# Altium schematic sheet Sheet4.SchDoc
size A3; DocumentNumber: 4; SheetNumber: 4; SheetTotal: 4
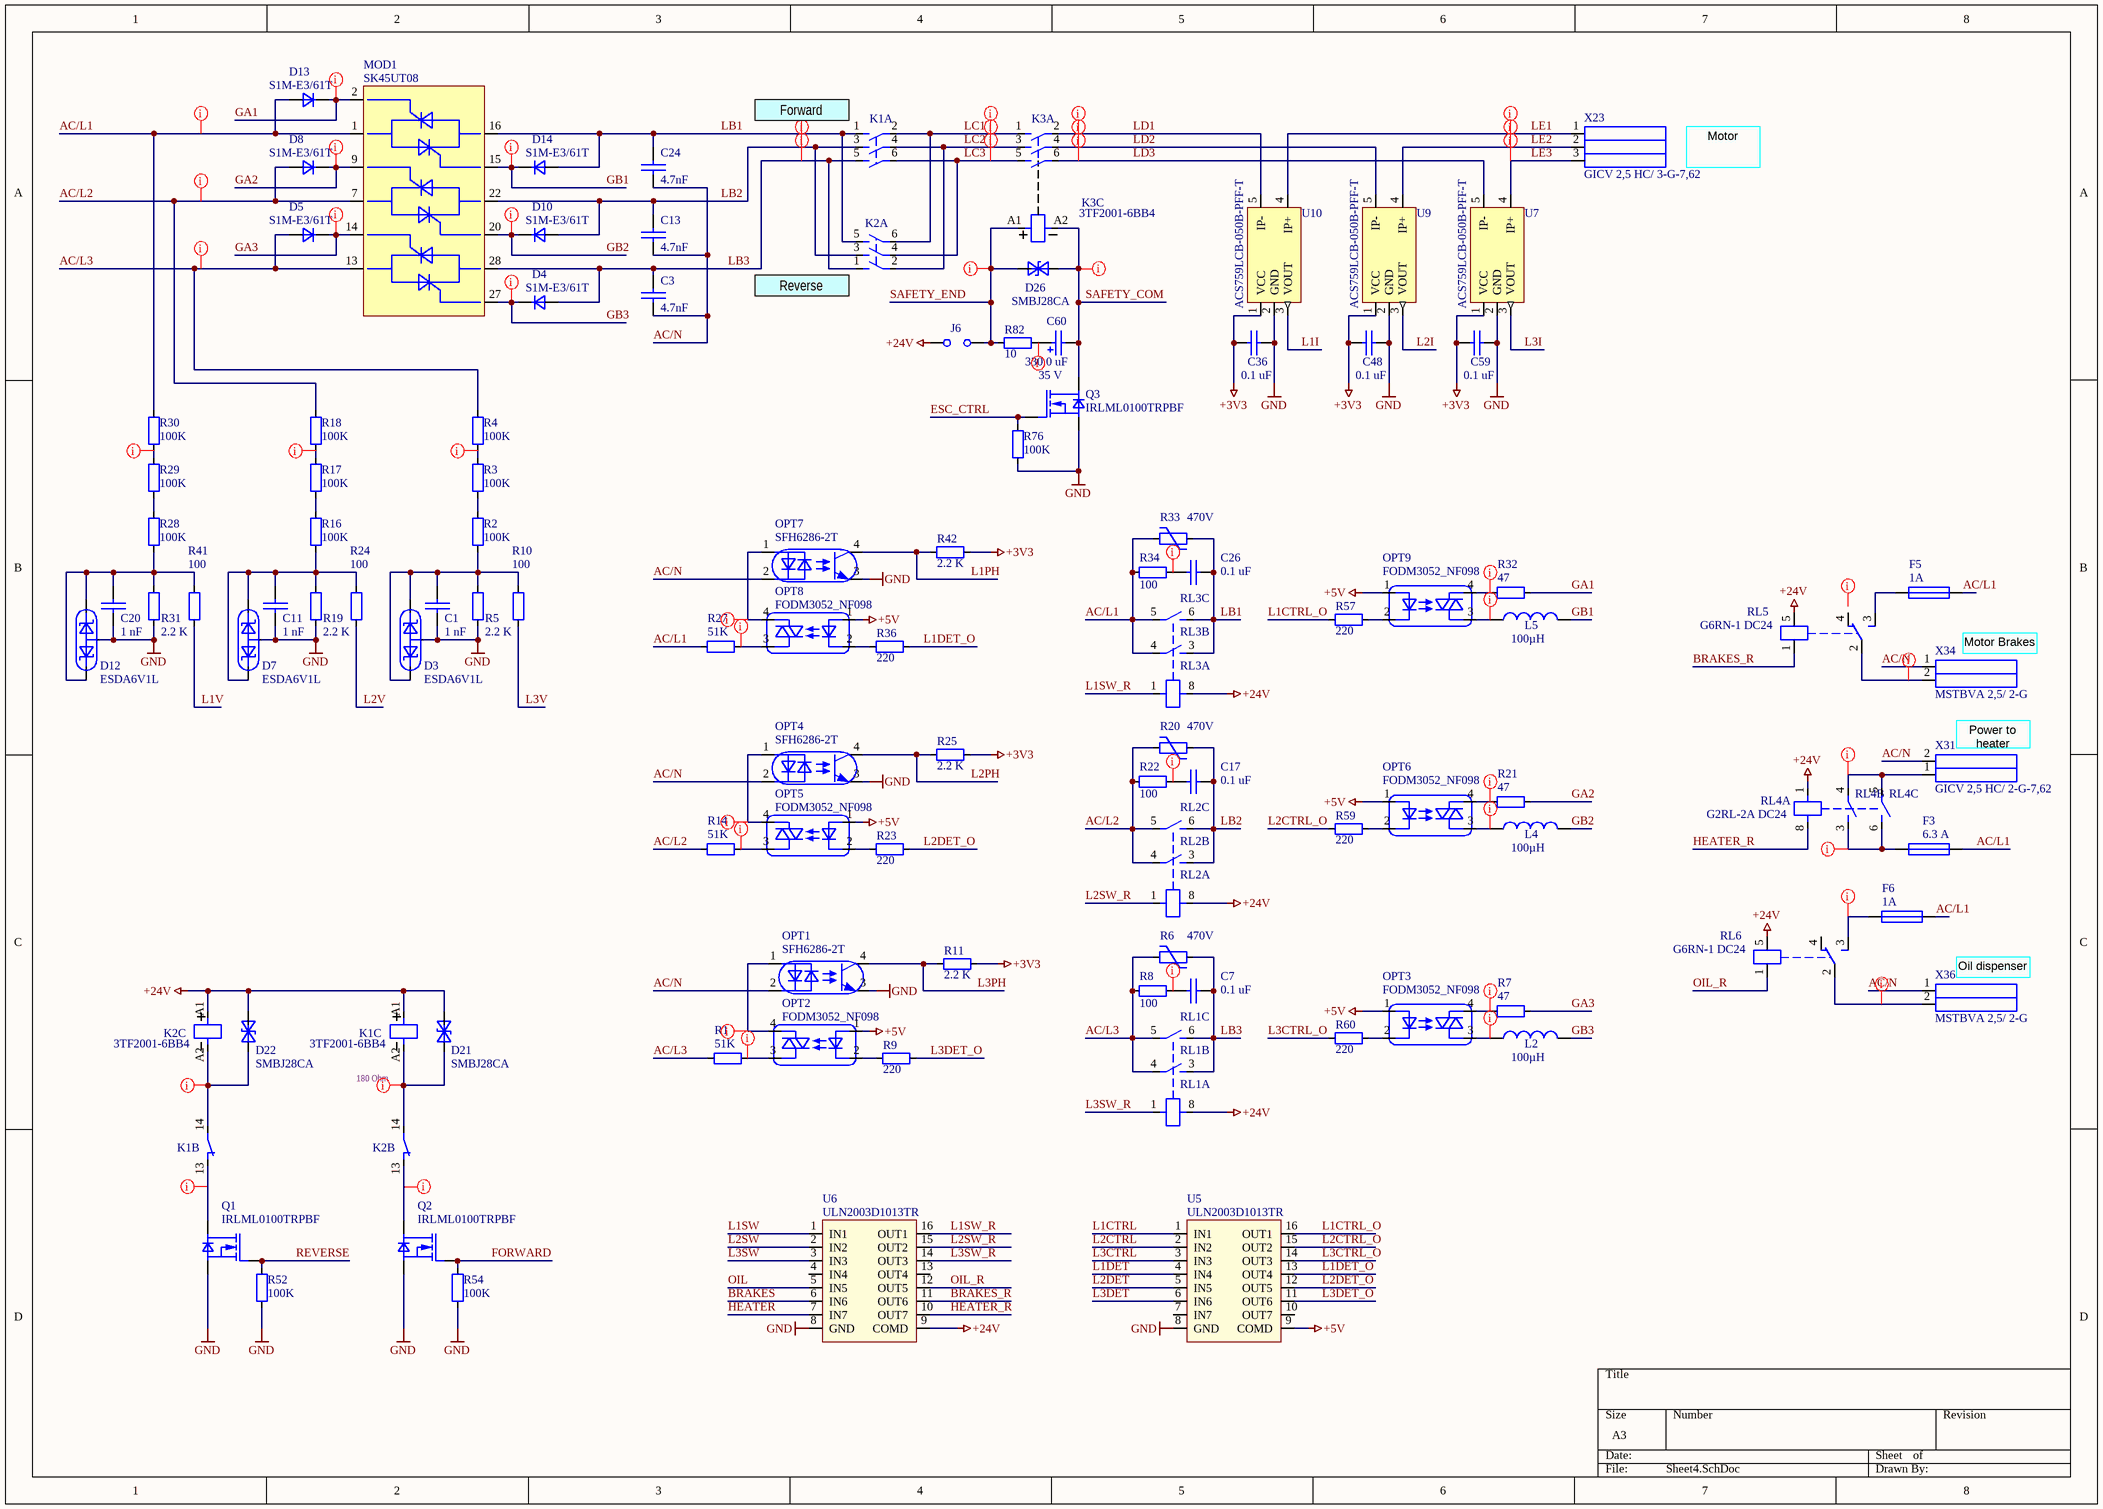
[diagram p0: Sheet4.SchDoc]

## Parts
C1  value 1 nF  [1608[0603]]  (hidden comment: CL10B102KB8NNNC)
C3  value 4.7nF  [DE2E3KH472M]  (hidden comment: DE2E3KH472MA3B)
C7  value 0.1 uF  [R46 Series 18mm]  (hidden comment: R46KI310040M1K1)
C11  value 1 nF  [1608[0603]]  (hidden comment: CL10B102KB8NNNC)
C13  value 4.7nF  [DE2E3KH472M]  (hidden comment: DE2E3KH472MA3B)
C17  value 0.1 uF  [R46 Series 18mm]  (hidden comment: R46KI310040M1K1)
C20  value 1 nF  [1608[0603]]  (hidden comment: CL10B102KB8NNNC)
C24  value 4.7nF  [DE2E3KH472M]  (hidden comment: DE2E3KH472MA3B)
C26  value 0.1 uF  [R46 Series 18mm]  (hidden comment: R46KI310040M1K1)
C36  value 0.1 uF  [1608[0603]]  (hidden comment: CL10B104KA8NNND)
C48  value 0.1 uF  [1608[0603]]  (hidden comment: CL10B104KA8NNND)
C59  value 0.1 uF  [1608[0603]]  (hidden comment: CL10B104KA8NNND)
C60  value 330.0 uF  Voltage: 35 V  [Alum.SMD Cap. 10*10]  (hidden comment: UUD1V331MNL1GS)
D3  ESDA6V1L  [SOT23]
D4  S1M-E3/61T  [SMA]
D5  S1M-E3/61T  [SMA]
D7  ESDA6V1L  [SOT23]
D8  S1M-E3/61T  [SMA]
D10  S1M-E3/61T  [SMA]
D12  ESDA6V1L  [SOT23]
D13  S1M-E3/61T  [SMA]
D14  S1M-E3/61T  [SMA]
D21  SMBJ28CA  [DO-214AA_SMBJ]
D22  SMBJ28CA  [DO-214AA_SMBJ]
D26  SMBJ28CA  [DO-214AA_SMBJ]
F3  value 6.3 A  [FUSE KS21SW]  (hidden comment: BK/HTC-15M)
F5  value 1A  [FUSE KS21SW]  (hidden comment: BK/HTC-15M)
F6  value 1A  [FUSE KS21SW]  (hidden comment: BK/HTC-15M)
J6  PH1-02-TA-HT  [HDR1X2V]  (value not drawn)
K1  3TF2001-6BB4  [3TF2010-6]  (value not drawn)  (parts A,B,C of 3)
K2  3TF2001-6BB4  [3TF2010-6]  (value not drawn)  (parts A,B,C of 3)
K3  3TF2001-6BB4  [3TF2010-6]  (value not drawn)  (parts A,C of 3)
L2  value 100µH  [NLV32]  (hidden comment: NLV32T-101J-PF)
L4  value 100µH  [NLV32]  (hidden comment: NLV32T-101J-PF)
L5  value 100µH  [NLV32]  (hidden comment: NLV32T-101J-PF)
MOD1  SK45UT08  [SK45UT08]
OPT1  SFH6286-2T  [SFH6286 Option]
OPT2  FODM3052_NF098  [4-SOP]
OPT3  FODM3052_NF098  [4-SOP]
OPT4  SFH6286-2T  [SFH6286 Option]
OPT5  FODM3052_NF098  [4-SOP]
OPT6  FODM3052_NF098  [4-SOP]
OPT7  SFH6286-2T  [SFH6286 Option]
OPT8  FODM3052_NF098  [4-SOP]
OPT9  FODM3052_NF098  [4-SOP]
Q1  IRLML0100TRPBF  [SOT23]
Q2  IRLML0100TRPBF  [SOT23]
Q3  IRLML0100TRPBF  [SOT23]
R1  value 51K  [Yageo CFR200]  (hidden comment: RSF200JB-73-51K)
R2  value 100K  [3216[1206]]  (hidden comment: ERJ-8ENF1003V)
R3  value 100K  [3216[1206]]  (hidden comment: ERJ-8ENF1003V)
R4  value 100K  [3216[1206]]  (hidden comment: ERJ-8ENF1003V)
R5  value 2.2 K  [0603]  (hidden comment: RC0603FR-072K2L)
R6  Voltage: 470V  [ERZ-V14D471]  (hidden comment: ERZV14D471)
R7  value 47  [CMB 0207]  (hidden comment: CMB02070X4709GB200)
R8  value 100  [Vyshai PR02]  (hidden comment: CFR-50JB-100R)
R9  value 220  [0603]  (hidden comment: RL0603E220-1)
R10  value 100  [0603]  (hidden comment: ERJ-3EKF1000V)
R11  value 2.2 K  [0603]  (hidden comment: RC0603FR-072K2L)
R14  value 51K  [Yageo CFR200]  (hidden comment: RSF200JB-73-51K)
R16  value 100K  [3216[1206]]  (hidden comment: ERJ-8ENF1003V)
R17  value 100K  [3216[1206]]  (hidden comment: ERJ-8ENF1003V)
R18  value 100K  [3216[1206]]  (hidden comment: ERJ-8ENF1003V)
R19  value 2.2 K  [0603]  (hidden comment: RC0603FR-072K2L)
R20  Voltage: 470V  [ERZ-V14D471]  (hidden comment: ERZV14D471)
R21  value 47  [CMB 0207]  (hidden comment: CMB02070X4709GB200)
R22  value 100  [Vyshai PR02]  (hidden comment: CFR-50JB-100R)
R23  value 220  [0603]  (hidden comment: RL0603E220-1)
R24  value 100  [0603]  (hidden comment: ERJ-3EKF1000V)
R25  value 2.2 K  [0603]  (hidden comment: RC0603FR-072K2L)
R27  value 51K  [Yageo CFR200]  (hidden comment: RSF200JB-73-51K)
R28  value 100K  [3216[1206]]  (hidden comment: ERJ-8ENF1003V)
R29  value 100K  [3216[1206]]  (hidden comment: ERJ-8ENF1003V)
R30  value 100K  [3216[1206]]  (hidden comment: ERJ-8ENF1003V)
R31  value 2.2 K  [0603]  (hidden comment: RC0603FR-072K2L)
R32  value 47  [CMB 0207]  (hidden comment: CMB02070X4709GB200)
R33  Voltage: 470V  [ERZ-V14D471]  (hidden comment: ERZV14D471)
R34  value 100  [Vyshai PR02]  (hidden comment: CFR-50JB-100R)
R36  value 220  [0603]  (hidden comment: RL0603E220-1)
R41  value 100  [0603]  (hidden comment: ERJ-3EKF1000V)
R42  value 2.2 K  [0603]  (hidden comment: RC0603FR-072K2L)
R52  value 100K  [0603]  (hidden comment: CRCW0603100KFKEAHP)
R54  value 100K  [0603]  (hidden comment: CRCW0603100KFKEAHP)
R57  value 220  [0603]  (hidden comment: RL0603E220-1)
R59  value 220  [0603]  (hidden comment: RL0603E220-1)
R60  value 220  [0603]  (hidden comment: RL0603E220-1)
R76  value 100K  [0603]  (hidden comment: CRCW0603100KFKEAHP)
R82  value 10  [3216[1206]]  (hidden comment: RL1206E010-1)
RL1  G2RL-2A DC24  [G2RL-2A]  (value not drawn)  (parts A,B,C of 3)
RL2  G2RL-2A DC24  [G2RL-2A]  (value not drawn)  (parts A,B,C of 3)
RL3  G2RL-2A DC24  [G2RL-2A]  (value not drawn)  (parts A,B,C of 3)
RL4  G2RL-2A DC24  [G2RL-2A]  (parts A,B,C of 3)
RL5  G6RN-1 DC24  [RELAY G6RN-1]
RL6  G6RN-1 DC24  [RELAY G6RN-1]
U5  ULN2003D1013TR  [SO-16]
U6  ULN2003D1013TR  [SO-16]
U7  ACS759LCB-050B-PFF-T  [ACS756]
U9  ACS759LCB-050B-PFF-T  [ACS756]
U10  ACS759LCB-050B-PFF-T  [ACS756]
X23  GICV 2,5 HC/ 3-G-7,62  [1756498 GICV 2,5 HC/ 3-G-7,62]
X31  GICV 2,5 HC/ 2-G-7,62  [1756485 GICV 2,5 HC/2 -G-7,62]
X34  MSTBVA 2,5/ 2-G  [CIM020P1]
X36  MSTBVA 2,5/ 2-G  [CIM020P1]

## Nets
+3V3: C36.1 C48.1 C59.1 R11.1 R25.1 R42.1 U7.1(VCC) U9.1(VCC) U10.1(VCC)
+5V: OPT2.1(A) OPT3.1(A) OPT5.1(A) OPT6.1(A) OPT8.1(A) OPT9.1(A) U5.9(COMD)
+24V: D21.2(A) D22.2(A) J6.2 K1.A1(+) K2.A1(+) RL1.8 RL2.8 RL3.8 RL4.1 RL5.5 RL6.5 U6.9(COMD)
GND: C1.2 C11.2 C20.2 C36.2 C48.2 C59.2 D3.3 D7.3 D12.3 OPT1.3(E) OPT4.3(E) OPT7.3(E) Q1.2(S) Q2.2(S) Q3.2(S) R5.2 R19.2 R31.2 R52.1 R54.1 R76.1 U5.8(GND) U6.8(GND) U7.2(GND) U9.2(GND) U10.2(GND)
AC/L1: D13.2 F3.1 F5.1 F6.1 MOD1.1 R27.1 R30.1 R33.2 R34.1 RL3.4 RL3.5
AC/L2: D8.2 MOD1.7 R14.1 R18.1 R20.2 R22.1 RL2.4 RL2.5
AC/L3: D5.2 MOD1.13 R1.1 R4.1 R6.2 R8.1 RL1.4 RL1.5
AC/N: C3.2 C13.2 C24.2 OPT1.2(C) OPT4.2(C) OPT7.2(C) X31.2 X34.1 X36.1
BRAKES: U6.6(IN6)
BRAKES_R: RL5.1 U6.11(OUT6)
ESC_CTRL: Q3.1(G) R76.2
FORWARD: Q2.1(G) R54.2
GA1: D13.1 MOD1.2 R32.2
GA2: D8.1 MOD1.9 R21.2
GA3: D5.1 MOD1.14 R7.2
GB1: D14.1 L5.2 MOD1.15
GB2: D10.1 L4.2 MOD1.20
GB3: D4.1 L2.2 MOD1.27
HEATER: U6.7(IN7)
HEATER_R: RL4.8 U6.10(OUT7)
L1CTRL: U5.1(IN1)
L1CTRL_O: R57.1 U5.16(OUT1)
L1DET: U5.4(IN4)
L1DET_O: R36.2 U5.13(OUT4)
L1I: U10.3(VOUT)
L1PH: OPT7.4(C) R42.2
L1SW: U6.1(IN1)
L1SW_R: RL3.1 U6.16(OUT1)
L1V: R41.2
L2CTRL: U5.2(IN2)
L2CTRL_O: R59.1 U5.15(OUT2)
L2DET: U5.5(IN5)
L2DET_O: R23.2 U5.12(OUT5)
L2I: U9.3(VOUT)
L2PH: OPT4.4(C) R25.2
L2SW: U6.2(IN2)
L2SW_R: RL2.1 U6.15(OUT2)
L2V: R24.2
L3CTRL: U5.3(IN3)
L3CTRL_O: R60.1 U5.14(OUT3)
L3DET: U5.6(IN6)
L3DET_O: R9.2 U5.11(OUT6)
L3I: U7.3(VOUT)
L3PH: OPT1.4(C) R11.2
L3SW: U6.3(IN3)
L3SW_R: RL1.1 U6.14(OUT3)
L3V: R10.2
LB1: C24.1 C26.2 D14.2 K1.1 K2.5 MOD1.16 R33.1 RL3.3 RL3.6
LB2: C13.1 C17.2 D10.2 K1.3 K2.3 MOD1.22 R20.1 RL2.3 RL2.6
LB3: C3.1 C7.2 D4.2 K1.5 K2.1 MOD1.28 R6.1 RL1.3 RL1.6
LC1: K1.2 K2.6 K3.1
LC2: K1.4 K2.2 K3.3
LC3: K1.6 K2.4 K3.5
LD1: K3.2 U10.5(IP-)
LD2: K3.4 U9.5(IP-)
LD3: K3.6 U7.5(IP-)
LE1: U10.4(IP+) X23.1
LE2: U9.4(IP+) X23.2
LE3: U7.4(IP+) X23.3
OIL: U6.5(IN5)
OIL_R: RL6.1 U6.12(OUT5)
REVERSE: Q1.1(G) R52.2
SAFETY_COM: C60.2 D26.1(C) K3.A2 Q3.3(D)
SAFETY_END: D26.2(A) J6.1 K3.A1(+) R82.2
NetC1_1: C1.1 D3.1 D3.2 R2.2 R5.1 R10.1
NetC7_1: C7.1 R8.2
NetC11_1: C11.1 D7.1 D7.2 R16.2 R19.1 R24.1
NetC17_1: C17.1 R22.2
NetC20_1: C20.1 D12.1 D12.2 R28.2 R31.1 R41.1
NetC26_1: C26.1 R34.2
NetC60_1: C60.1 R82.1
NetD21_1: D21.1(C) K1.A2 K2.14
NetD22_1: D22.1(C) K1.14 K2.A2
NetF3_2: F3.2 RL4.3 RL4.6
NetF5_2: F5.2 RL5.3
NetF6_2: F6.2 RL6.3
NetK1_13: K1.13 Q1.3(D)
NetK2_13: K2.13 Q2.3(D)
NetL2_1: L2.1 OPT3.3(E)
NetL4_1: L4.1 OPT6.3(E)
NetL5_1: L5.1 OPT9.3(E)
NetOPT1_1: OPT1.1(A) OPT2.4(C)
NetOPT2_2: OPT2.2(C) R9.1
NetOPT2_3: OPT2.3(E) R1.2
NetOPT3_2: OPT3.2(C) R60.2
NetOPT3_4: OPT3.4(C) R7.1
NetOPT4_1: OPT4.1(A) OPT5.4(C)
NetOPT5_2: OPT5.2(C) R23.1
NetOPT5_3: OPT5.3(E) R14.2
NetOPT6_2: OPT6.2(C) R59.2
NetOPT6_4: OPT6.4(C) R21.1
NetOPT7_1: OPT7.1(A) OPT8.4(C)
NetOPT8_2: OPT8.2(C) R36.1
NetOPT8_3: OPT8.3(E) R27.2
NetOPT9_2: OPT9.2(C) R57.2
NetOPT9_4: OPT9.4(C) R32.1
NetR2_1: R2.1 R3.2
NetR3_1: R3.1 R4.2
NetR16_1: R16.1 R17.2
NetR17_1: R17.1 R18.2
NetR28_1: R28.1 R29.2
NetR29_1: R29.1 R30.2
NetRL4_4: RL4.4 RL4.5 X31.1
NetRL5_2: RL5.2 X34.2
NetRL6_2: RL6.2 X36.2

Not connected (* = marked no-connect by the designer): RL5 4; RL6 4; U5 7(IN7) 10(OUT7); U6 4(IN4) 13(OUT4)

## Layout directives
net class L1: (no net found under the mark), AC/L1, GA1, GB1, LB1, LC1, LD1, LE1, NetC26_1, NetF3_2, NetF6_2, NetL5_1, NetOPT8_3, NetOPT9_4, NetRL4_4, NetRL5_2, NetRL6_2
net class 24V: NetC60_1, NetD21_1, NetD22_1, NetK1_13, NetK2_13, SAFETY_COM, SAFETY_END
net class L2: AC/L2, GA2, GB2, LB2, LC2, LD2, LE2, NetC17_1, NetL4_1, NetOPT5_3, NetOPT6_4
net class L3: AC/L3, GA3, GB3, LB3, LC3, LD3, LE3, NetC7_1, NetL2_1, NetOPT2_3, NetOPT3_4
net class OPT: NetOPT1_1, NetOPT4_1, NetOPT7_1
net class 1.5mm: NetR3_1, NetR17_1, NetR29_1

## Notes on the sheet
- (near K1) Forward
- Motor
- (near K2) Reverse
- Motor Brakes
- (near X31) Power to heater
  Imax 10A
- (near X36) Oil dispenser
- 180 Ohm

## Library data of the parts
C1 C11 C20 = CVNF1.0K0603_1: 1 nF, 50V, 10%, X7R, 0603 SMD MLC Capacitor; Manufacturer: SAMSUNG; Tolerance: 10%; Distributor: Future; Price: 0.002$; PartNum: CL10B102KB8NNNC; Voltage: 50 V; PartName: CL10B102KB8NNNC
C3 C13 C24 = DE2E3KH472MA3B: 4700 pF, 20%, 250VAC, CAP CER X1,Y2,   THT 7.5mm; X1,Y2; Manufacturer: Murata; Distributor: TME; PartNum: DE2E3KH472MA3B; Price: 0.622; Tolerance: 20%; PartName: DE2E3KH472MA3B; Voltage: 250VAC
C7 C17 C26 = R46KI310040M1K1: 0.1 uF, 560 Vdc, 275 Vac, X2, -40..+110C; Manufacturer: Kemet; PartNum: 399-9649-ND; Tolerance: 10%; Voltage: 560 Vdc; Price: 0.32$; Distributor: Digi-Key; PartName: R46KI310040M1K1
C36 C48 C59 = CVNF100K0603-25: 0.1 uF, 25V, 10% , X7R,  0603 SMD MLC Capacitor; Manufacturer: SAMSUNG; Tolerance: 10%; Distributor: Future; Price: 0.0026 Euro; Voltage: 25 V; PartNum: CL10B104KA8NNND; PartName: CL10B104KA8NNND
C60 = UUD1V331MNL1GS: Low ESR SMD alum.el.capacitor 35V, 330uF, 90 mOhm, 670 mA, 10x10, -50...+105 C; Manufacturer: Nichicon; PartNum: 493-2293-1-ND; Tolerance: 20%; Distributor: Digi-Key; Price: 1.1$; PartName: UUD1V331MNL1GS
D3 D7 D12 = ESDA6V1L: Dual transil array for ESD, 6.1 V, 300 W; Manufacturer: Micro Commercial Co; PartNum: ESDA6V1L-TPCT-ND; PartName: ESDA6V1L-TP; Distributor: Digi-Key; Price: 0.23$
D4 D5 D8 D10 D13 D14 = S1M-E3/61T: DIODE GEN PURP 1KV 1A DO214AC; Manufacturer: Vishay Semiconductor Diodes Division; PartNum: S1M-E3/61TGICT-ND; Price: 0.65$; Distributor: Digi-Key; PartName: S1M-E3/61T
D21 D22 D26 = SMBJ28CA: TVS 600W 28V Bidirectional; Manufacturer: Littelfuse; PartNum: SMBJ28CABCT-ND; Distributor: DigiKey; Price: 0.38$
F3 F5 F6 = BK/HTC-15M: FUSE HOLDER KS21SW; Manufacturer: Cooper/Bussmann; PartNum: 283-2923-ND; Distributor: Digi-Key; Price: 0.74$; PartName: BK/HTC-15M
J6 = Jumper: 2 Pos. 2.54 mm Single Row Through Hole Straight Pin Header; Manufacturer: ADAM TECH; Distributor: Future; Price: 0.02 Euro; PartNum: PH1-02-TA-HT; PartName: PH1-02-TA-HT
K1-K3 = 3TF2001-6BB4: Contactor: 3-pole; Auxiliary contacts: NC; 24VDC; 9A; NO x3; PCB; Manufacturer: Siemens; PartNum: 3TF2001-6BB4; Distributor: TME; Price: 57.14; PartName: 3TF2001-6BB4
L2 L4 L5 = NLV32T-101J-PF: INDUCTOR POWER 100UH 1210; Manufacturer: TDK Corporation; PartNum: 445-1529-1-ND; Distributor: Digi-Key; Price: 0.27$; PartName: NLV32T-101J-PF
MOD1 = SK45UT08: 47A 800V thyristor module; Manufacturer: Semikron; Distributor: sindopower.com; PartName: SK45UT08; PartNum: SK45UT08
OPT1 OPT4 OPT7 = SFH6286-2T: OPTOISOLATOR 5.3KV TRANS 4-SMD; Manufacturer: Vishay Semiconductor Opto Division; PartNum: SFH6286-2TCT-ND; Price: 1.47$; Distributor: Digi-Key; PartName: SFH6286-2T
OPT2 OPT3 OPT5 OPT6 OPT8 OPT9 = FODM3052_NF098: OPTOCOUPLER TRIAC OUT 600V 4SMD; Manufacturer: Fairchild Semiconductor; PartNum: FODM3052_NF098-ND; Price: 1.22$; Distributor: Digi-Key; PartName: FODM3052_NF098
Q1-Q3 = IRLML0100TRPBF: N-channel MOSFET, 100V, 1.6A, 0.33 Ohm 3.3 V, SOT-23; Manufacturer: International Rectifier; PartNum: IRLML0100TRPBFCT-ND; Price: 0.6$; Distributor: Digi-Key; PartName: IRLML0100TRPBF
R1 R14 R27 = RSF200JB-73-51K: 51K,  2W, 5% AXIAL; Manufacturer: Yageo; PartNum: 51KW-2-ND; Price: 0.29$; Distributor: Digi-Key; Tolerance: 5%; PartName: RSF200JB-73-51K
R2-R4 R16-R18 R28-R30 = RL1206K100-1: 100K, 1%,  1206,  200v,  SMD 1206; Manufacturer: Panasonic; Distributor: Future; PartNum: ERJ-8ENF1003V; Price: 0.0036Euro; Voltage: 200V; Tolerance: 1%; PartName: ERJ-8ENF1003V
R5 R11 R19 R25 R31 R42 = RL0603K002.2-1_1: 2.2 K, 1%, 0603, SMD Resistor, Taped; Manufacturer: YAGEO AMERICA CORPORATION; Voltage: 75 V; Distributor: Future; Price: 0.0017$; Tolerance: 1%; PartNum: RC0603FR-072K2L; PartName: RC0603FR-072K2L
R6 R20 R33 = ERZV14D471: VARISTOR Disc 14mm, 6kA, 175J,; Manufacturer: PANASONIC; Distributor: Farnell; PartNum: ERZV14D471; Price: 2.08; PartName: ERZV14D471
R7 R21 R32 = CMB02070X4709GB200: RES 47 OHM 1W 2% 0207 MELF; Manufacturer: Vishay Beyschlag; PartNum: CMB-47CT-ND; Voltage: 500V; Distributor: Digi-Key; Price: 0.3$; Tolerance: 2%; PartName: CMB02070X4709GB200
R8 R22 R34 = CFR-50JB-100R: RES 100 OHM 1/2W 5% CARBON FILM; Manufacturer: Yageo; PartNum: 100H-ND; Voltage: 300V; Price: 0.093$; Distributor: DigiKey; Tolerance: 5%; PartName: CFR-50JB-100R
R9 R23 R36 R57 R59 R60 = RL0603E220-1: 220 R, 1%, 0603, SMD Resistor, Taped; Manufacturer: Vishay; Voltage: 75 V; Distributor: Schukat; Price: 0.002 Euro; Tolerance: 1%; PartNum: RL0603E220-1; PartName: RL0603E220-1
R10 R24 R41 = RL0603E100-1_1: 100, 1%, 0603, SMD Resistor, Taped; Manufacturer: PANASONIC; Voltage: 75 V; Distributor: Future; Price: 0.0017$; Tolerance: 1%; PartNum: ERJ-3EKF1000V; PartName: ERJ-3EKF1000V
R52 R54 R76 = RL0603K100-1: 100K, 1%, 0603, SMD Resistor, Taped; Manufacturer: Vishay Dale; Voltage: 75 V; Distributor: Digi-Key; Price: 0.002 Euro; Tolerance: 1%; PartNum: CRCW0603100KFKEAHP; PartName: CRCW0603100KFKEAHP
R82 = RL1206E010-1: 10 Ohm, 1%, SMD 1206; Manufacturer: VISHAY; Voltage: 200; Distributor: Schukat; Price: 0.03 Euro; Tolerance: 1%; PartNum: RL1206E010-1; PartName: RL1206E010-1
RL1-RL4 = G2RL-2A DC24: RELAY GEN PURPOSE DPST 8A 24V; PartNum: Z3091-ND; Manufacturer: Omron Electronics Inc-EMC Div; Distributor: Digi-Key; Price: 3.38$; PartName: G2RL-2A DC24
RL5 RL6 = G6RN-1 DC24: PartNum: Z990-ND; Manufacturer: Omron Electronics Inc-ECB Div; Distributor: Digi-Key; Price: 2.67$; PartName: G6RN-1 DC24
U5 U6 = ULN2003D1013TR: TRANS 7 NPN DARL 50V 500MA 16SO; Manufacturer: STMicroelectronics; PartNum: 497-2345-1-ND; Distributor: DigiKey; Price: 0.52$; PartName: ULN2003D1013TR
U7 U9 U10 = ACS759LCB-050B-PFF-T: IC HALL EFFECT SENSOR 50A, 3V; Manufacturer: Allegro Microsystems Inc; PartNum: 620-1467-5-ND; Price: 4.66$; Distributor: DigiKey; PartName: ACS759LCB-050B-PFF-T
X23 = GICV 2,5 HC/ 3-G-7,62: Header, Nominal current: 16 A, Rated voltage (III/2): 320 V, Number of positions: 3, Pitch: 5.08 mm, Color: green; Manufacturer: PHOENIX CONTACT; PartNum: 1756498; Distributor: PHOENIX CONTACT; Price: 0.99 Euro; PartName: GICV 2,5 HC/ 3-G-7,62
X31 = GICV 2,5 HC/ 2-G-7,62: Header, Nominal current: 16 A, Rated voltage (III/2): 630 V, Number of positions: 2, Pitch: 7.62 mm, Color: green; Manufacturer: PHOENIX CONTACT; PartNum: 1756485; Distributor: PHOENIX CONTACT; Price: 0.66 Euro; PartName: GICV 2,5 HC/ 2-G-7,62
X34 X36 = 796636-2: TERM BLOCK HEADER 2POS 5.08MM; Manufacturer: Phoenix Contact; PartNum: 1755516; Distributor: Phoenix Contact; Price: 0.204 Euro; PartName: MSTBVA 2,5/ 2-G